# EasyEDA Pro project stm32h7手持mp3.eprj, schematic Schematic1
Board Name: Board1; Create Date: 2026-05-27; Page Name: mcu; Project Name: stm32h7手持mp3; Schematic Name: Schematic1; Update Date: 2026-06-16; Company: 嘉立创EDA; Page Size: A4; Version: V1.0
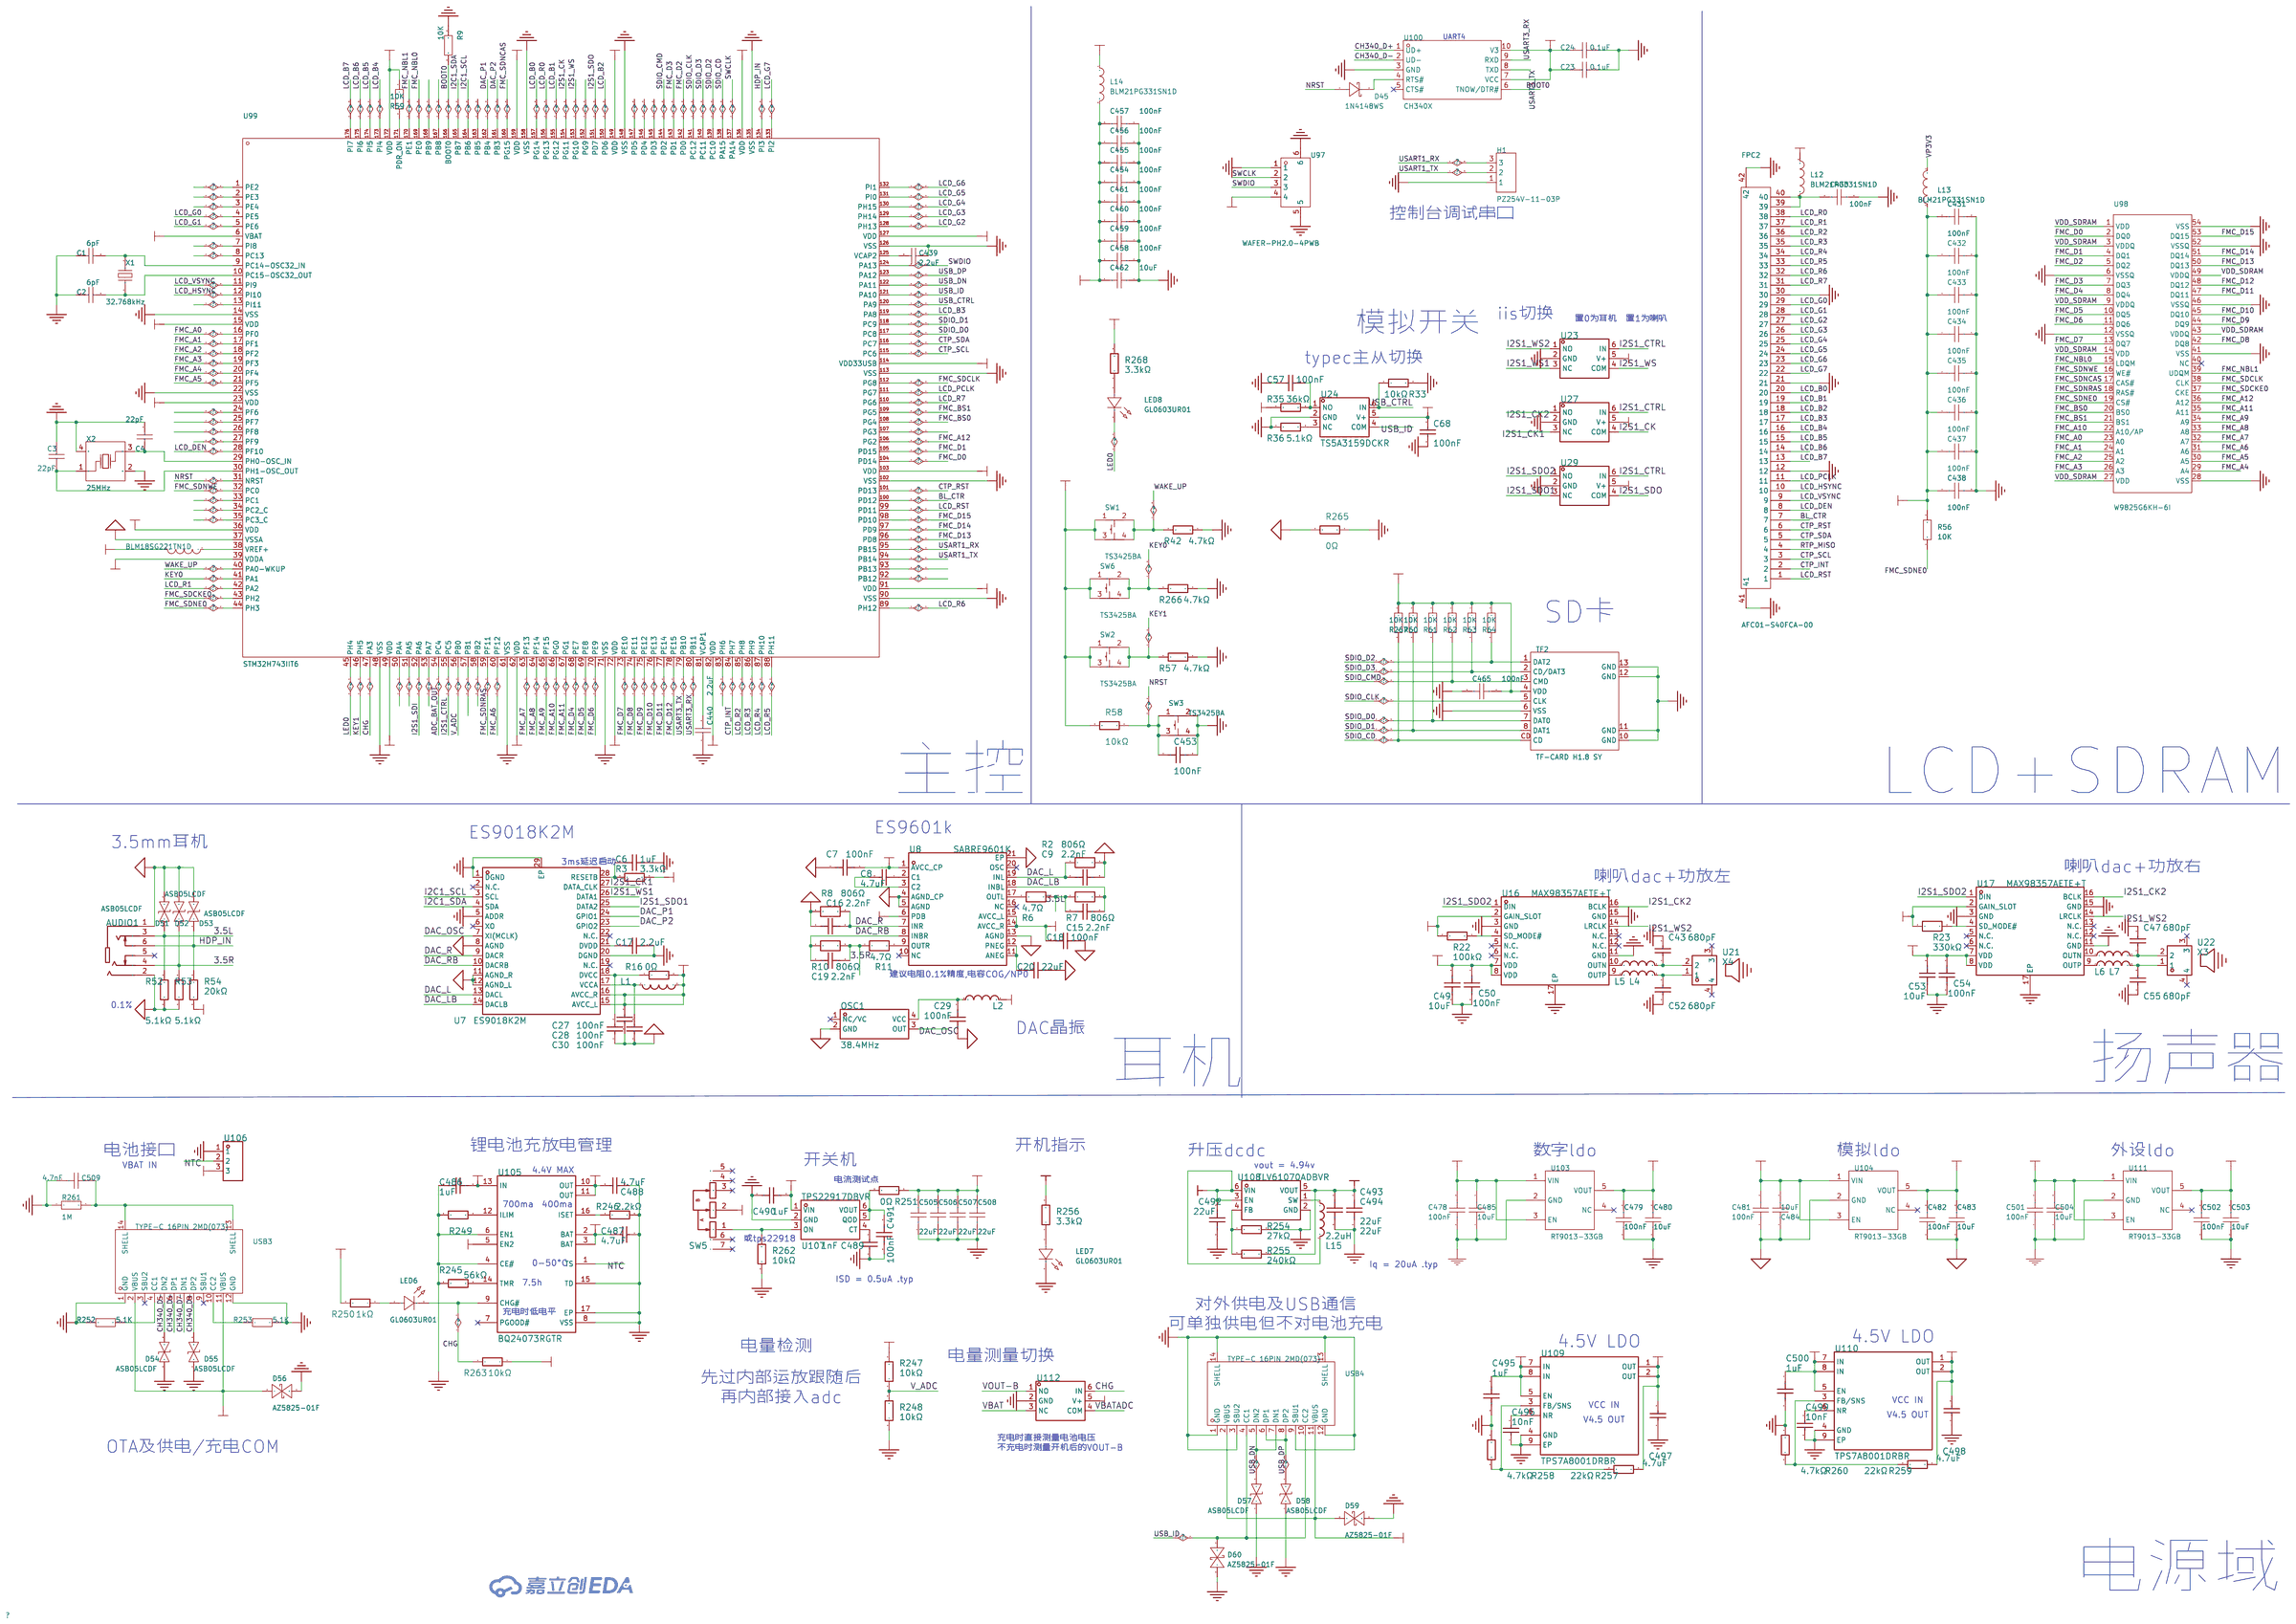
[diagram p0: schematic sheet]

## Parts
AUDIO1  PJ-3420-A-SMT  [AUDIO-SMD_PJ-3420-A-SMT_C319102]
C1  6pF  [C0603]
C2  6pF  [C0603]
C3  22pF  [C0603]
C4  22pF  [C0603]
C6  1uF  [C0603]
C7  100nF  [C0603]
C8  4.7uF  [C0603]
C9  2.2nF  [C0603]
C15  2.2nF  [C0603]
C16  2.2nF  [C0603]
C17  2.2uF  [C0603]
C18  100nF  [C0603]
C19  2.2nF  [C0603]
C20  22uF  [C0603]
C23  0.1uF  [C0603]
C24  0.1uF  [C0603]
C27  100nF  [C0603]
C28  100nF  [C0603]
C29  100nF  [C0603]
C30  100nF  [C0603]
C43  680pF  [C0603]
C47  680pF  [C0603]
C49  10uF  [C0603]
C50  100nF  [C0603]
C52  680pF  [C0603]
C53  10uF  [C0603]
C54  100nF  [C0603]
C55  680pF  [C0603]
C57  100nF  [C0603]
C68  100nF  [C0603]
C430  100nF  [C0603]
C431  100nF  [C0603]
C432  100nF  [C0603]
C433  100nF  [C0603]
C434  100nF  [C0603]
C435  100nF  [C0603]
C436  100nF  [C0603]
C437  100nF  [C0603]
C438  100nF  [C0603]
C439  2.2uF  [C0603]
C440  2.2uF  [C0603]
C453  100nF  [C0603]
C454  100nF  [C0603]
C455  100nF  [C0603]
C456  100nF  [C0603]
C457  100nF  [C0603]
C458  100nF  [C0603]
C459  100nF  [C0603]
C460  100nF  [C0603]
C461  100nF  [C0603]
C462  10uF  [C0603]
C465  100nF  [C0603]
C478  100nF  [C0603]
C479  100nF  [C0603]
C480  10uF  [C0603]
C481  100nF  [C0603]
C482  100nF  [C0603]
C483  10uF  [C0603]
C484  10uF  [C0603]
C485  10uF  [C0603]
C486  1uF  [C0603]
C487  4.7uF  [C0603]
C488  4.7uF  [C0603]
C489  1nF  [C0603]
C490  1uF  [C0603]
C491  100nF  [C0603]
C492  22uF  [C0603]
C493  22uF  [C0603]
C494  22uF  [C0603]
C495  1uF  [C0603]
C496  10nF  [C0603]
C497  4.7uF  [C0603]
C498  4.7uF  [C0603]
C499  10nF  [C0603]
C500  1uF  [C0603]
C501  100nF  [C0603]
C502  100nF  [C0603]
C503  10uF  [C0603]
C504  10uF  [C0603]
C505  22uF  [C0805]
C506  22uF  [C0805]
C507  22uF  [C0805]
C508  22uF  [C0805]
C509  4.7nF  [C0603]
D45  1N4148WS  [SOD-323_L1.7-W1.3-LS2.5-FD]
D51  ASB05LCDF  [DFN-2L_L1.0-W0.6-P0.65-BI]
D52  ASB05LCDF  [DFN-2L_L1.0-W0.6-P0.65-BI]
D53  ASB05LCDF  [DFN-2L_L1.0-W0.6-P0.65-BI]
D54  ASB05LCDF  [DFN-2L_L1.0-W0.6-P0.65-BI]
D55  ASB05LCDF  [DFN-2L_L1.0-W0.6-P0.65-BI]
D56  AZ5825-01F  [DFN-2L_L1.0-W0.6-P0.65-BI]
D57  ASB05LCDF  [DFN-2L_L1.0-W0.6-P0.65-BI]
D58  ASB05LCDF  [DFN-2L_L1.0-W0.6-P0.65-BI]
D59  AZ5825-01F  [DFN-2L_L1.0-W0.6-P0.65-BI]
D60  AZ5825-01F  [DFN-2L_L1.0-W0.6-P0.65-BI]
FPC2  AFC01-S40FCA-00  [FPC-SMD_AFC01-S40FCA-00]
H1  PZ254V-11-03P  [HDR-TH_3P-P2.54-V-M_PZ254V-11-03P]
L1  BLM18EG221SN1D  [L0603]
L2  BLM18EG221SN1D  [L0603]
L4  BLM18EG221SN1D  [L0603]
L5  BLM18EG221SN1D  [L0603]
L6  BLM18EG221SN1D  [L0603]
L7  BLM18EG221SN1D  [L0603]
L11  BLM18SG221TN1D  [L0603]
L12  BLM21PG331SN1D  [L0805]
L13  BLM21PG331SN1D  [L0805]
L14  BLM21PG331SN1D  [L0805]
L15  2.2uH  [IND-SMD_L5.4-W5.2_FXL0530]
LED6  GL0603UR01  [LED0603-FD]
LED7  GL0603UR01  [LED0603-FD]
LED8  GL0603UR01  [LED0603-FD]
OSC1  38.4MHz  [OSC-SMD_4P-L2.0-W1.6-BL_DSB211SDN]
R2  806Ω  [R0603]
R3  3.3kΩ  [R0603]
R6  4.7Ω  [R0603]
R7  806Ω  [R0603]
R8  806Ω  [R0603]
R9  10K  [R0603]
R10  806Ω  [R0603]
R11  4.7Ω  [R0603]
R16  0Ω  [R0603]
R22  100kΩ  [R0603]
R23  330kΩ  [R0603]
R33  10kΩ  [R0603]
R35  36kΩ  [R0603]
R36  5.1kΩ  [R0603]
R42  4.7kΩ  [R0603]
R52  5.1kΩ  [R0603]
R53  5.1kΩ  [R0603]
R54  20kΩ  [R0603]
R56  10K  [R0603]
R57  4.7kΩ  [R0603]
R58  10kΩ  [R0603]
R59  10K  [R0603]
R60  10K  [R0603]
R61  10K  [R0603]
R62  10K  [R0603]
R63  10K  [R0603]
R64  10K  [R0603]
R245  56kΩ  [R0603]
R246  2.2kΩ  [R0603]
R247  10kΩ  [R0603]
R248  10kΩ  [R0603]
R249  2.2kΩ  [R0603]
R250  1kΩ  [R0603]
R251  0Ω  [R0603]
R252  5.1K  [R0603]
R253  5.1K  [R0603]
R254  27kΩ  [R0603]
R255  240kΩ  [R0603]
R256  3.3kΩ  [R0603]
R257  22kΩ  [R0603]
R258  4.7kΩ  [R0603]
R259  22kΩ  [R0603]
R260  4.7kΩ  [R0603]
R261  1M  [R0603]
R262  10kΩ  [R0603]
R263  10kΩ  [R0603]
R265  0Ω  [R0603]
R266  4.7kΩ  [R0603]
R267  10K  [R0603]
R268  3.3kΩ  [R0603]
SW1  TS3425BA  [SW-SMD_4P-L4.2-W3.2-P2.15-LS4.6-1]
SW2  TS3425BA  [SW-SMD_4P-L4.2-W3.2-P2.15-LS4.6-1]
SW3  TS3425BA  [SW-SMD_4P-L4.2-W3.2-P2.15-LS4.6-1]
SW5  MK-12C02-G020  [SW-SMD_MK-12C02-G020]
SW6  TS3425BA  [SW-SMD_4P-L4.2-W3.2-P2.15-LS4.6-1]
TF2  TF-CARD H1.8 SY  [TF-SMD_TF-012]
U7  ES9018K2M  [QFN-28_L5.0-W5.0-P0.50-BL-EP3.3]
U8  SABRE9601K  [QFN-20_L3.0-W3.0-P0.40-TL-EP1.7]
U16  MAX98357AETE+T  [TQFN-16_L3.0-W3.0-P0.50-BL-EP1.5]
U17  MAX98357AETE+T  [TQFN-16_L3.0-W3.0-P0.50-BL-EP1.5]
U21  -  [扬声器左]
U22  -  [扬声器右]
U23  TS5A3159DCKR  [SC-70-6_L2.0-W1.3-P0.65-LS2.1-BL-1]
U24  TS5A3159DCKR  [SC-70-6_L2.0-W1.3-P0.65-LS2.1-BL-1]
U27  TS5A3159DCKR  [SC-70-6_L2.0-W1.3-P0.65-LS2.1-BL-1]
U29  TS5A3159DCKR  [SC-70-6_L2.0-W1.3-P0.65-LS2.1-BL-1]
U97  WAFER-PH2.0-4PWB  [CONN-SMD_4P-P2.00_XUNPU_WAFER-PH2.0-4PWB]
U98  W9825G6KH-6I  [TSOP-54_L22.2-W10.2-P0.80-LS11.8-BL]
U99  STM32H743IIT6  [LQFP-176_L24.0-W24.0-P0.50-LS26.0-BL]
U100  CH340X  [MSOP-10_L3.0-W3.0-P0.50-LS5.0-BL]
U103  RT9013-33GB  [SOT-23-5_L3.0-W1.7-P0.95-LS2.8-BL]
U104  RT9013-33GB  [SOT-23-5_L3.0-W1.7-P0.95-LS2.8-BL]
U105  BQ24073RGTR  [QFN-16_L3.0-W3.0-P0.50-TL-EP1.7]
U106  BX-PH2.0-3PWZ  [CONN-TH_3P-P2.00_BX-PH2.0-3PWZ]
U107  TPS22917DBVR  [SOT-23-6_L2.9-W1.6-P0.95-LS2.8-BR]
U108  TLV61070ADBVR  [SOT-23-6_L2.9-W1.6-P0.95-LS2.8-BR]
U109  TPS7A8001DRBR  [VSON-8_L3.0-W3.0-P0.65-TL-EP]
U110  TPS7A8001DRBR  [VSON-8_L3.0-W3.0-P0.65-TL-EP]
U111  RT9013-33GB  [SOT-23-5_L3.0-W1.7-P0.95-LS2.8-BL]
U112  TS5A3159DCKR  [SC-70-6_L2.0-W1.3-P0.65-LS2.1-BL-1]
USB3  TYPE-C 16PIN 2MD(073)  [USB-C-SMD_TYPE-C-6PIN-2MD-073]
USB4  TYPE-C 16PIN 2MD(073)  [USB-C-SMD_TYPE-C-6PIN-2MD-073]
X1  32.768kHz  [OSC-SMD_L3.2-W1.5]
X2  25MHz  [CRYSTAL-SMD_4P-L3.2-W2.5-BL]
X3  GH125-S02DCA-00  [CONN-SMD_2P-P1.25_JUSHUO_GH125-S02DCA-00]
X4  GH125-S02DCA-00  [CONN-SMD_2P-P1.25_JUSHUO_GH125-S02DCA-00]

## Library data of the parts
AUDIO1 = PJ-3420-A-SMT: 连接器类型:3.5mm耳机座;额定电流:500mA;额定电压:30V;工作温度:-20℃~+70℃;; LCSC Part Name: 3.5mm耳机座; Supplier Part: C319102; Manufacturer: XKB Connection(中国星坤); Supplier Footprint: SMD; JLCPCB Part Class: Extended Part; Datasheet: https://item.szlcsc.com/datasheet/PJ-3420-A-SMT/300194.html; Supplier: LCSC; Connector Type: 3.5mm耳机座; Current Rating (Max): 500mA; Voltage Rating (Max): 30V; Operating Temperature Range: -20℃~+70℃; Soldering Temperature(Max): 235℃; Current Rating: 500mA; Operating Temperature: -20℃~+70℃
C1-C4 C23 C24 C439 C440 = 0603CG6R0C500NT: 容值:6pF;额定电压:50V;温度系数:C0G;; LCSC Part Name: ±0.25pF 6pF 50V; Supplier Part: C37474; Manufacturer: FH(风华); Supplier Footprint: 0603; JLCPCB Part Class: 扩展库; Datasheet: https://atta.szlcsc.com/upload/public/pdf/source/20200305/C486355_26A10D38EF8C2A5C37091D0039909270.pdf; Supplier: LCSC; Voltage Rating: 50V; Temperature Coefficient: C0G
C6 C486 C490 = CC0603JRX7R7BB105: LCSC Part Name: 1uF ±5% 16V; Supplier Part: C519560; Manufacturer: YAGEO(国巨); Supplier Footprint: 0603; JLCPCB Part Class: 扩展库; Datasheet: https://atta.szlcsc.com/upload/public/pdf/source/20200423/C519560_04055A817EC1D690632F33783E937415.pdf; Supplier: LCSC; Tolerance: ±5%; Voltage Rated: 16V; Temperature Coefficient: X7R
C7 C18 C29 C50 C54 C453 C491 = CGA0603X7R104K500JT: LCSC Part Name: 100nF ±10% 50V; Supplier Part: C6119867; Manufacturer: HRE(芯声); Supplier Footprint: 0603; Supplier: LCSC; Tolerance: ±10%; Voltage Rated: 50V; Temperature Coefficient: X7R
C8 C487 C488 = CL10A475KO8NNNC: LCSC Part Name: 4.7uF ±10% 16V; Supplier Part: C19666; Manufacturer: SAMSUNG(三星); Supplier Footprint: 0603; Datasheet: https://atta.szlcsc.com/upload/public/pdf/source/20160218/1457707763339.pdf; Supplier: LCSC; Tolerance: ±10%; Voltage Rated: 16V; Temperature Coefficient: X5R
C9 C15 C16 C19 = GRM1885C1H222FA01D: LCSC Part Name: 2.2nF ±1% 50V 停产; Supplier Part: C882523; Manufacturer: muRata(村田); Supplier Footprint: 0603; JLCPCB Part Class: 扩展库; Datasheet: https://atta.szlcsc.com/upload/public/pdf/source/20220630/6FA8AFF045350095082060A18D4DB533.pdf; Supplier: LCSC; Tolerance: ±1%; Voltage Rated: 50V; Temperature Coefficient: C0G
C17 = CL10A225KB8NNNC: LCSC Part Name: 2.2uF ±10% 50V; Supplier Part: C913904; Manufacturer: SAMSUNG(三星); Supplier Footprint: 0603; JLCPCB Part Class: 扩展库; Datasheet: https://atta.szlcsc.com/upload/public/pdf/source/20160218/1457707763339.pdf; Supplier: LCSC; Tolerance: ±10%; Voltage Rated: 50V; Temperature Coefficient: X5R
C20 = CL10A226MP8NUNE: LCSC Part Name: 22uF ±20% 10V; Supplier Part: C86295; Manufacturer: SAMSUNG(三星); Supplier Footprint: 0603; JLCPCB Part Class: 扩展库; Datasheet: https://atta.szlcsc.com/upload/public/pdf/source/20160218/1457707763339.pdf; Supplier: LCSC; Tolerance: ±20%; Voltage Rated: 10V; Temperature Coefficient: X5R
C27 C28 C30 C57 C68 = 0603B104K500NT: LCSC Part Name: 100nF ±10% 50V; Supplier Part: C30926; Manufacturer: FH(风华); Supplier Footprint: 0603; JLCPCB Part Class: 扩展库; Datasheet: https://atta.szlcsc.com/upload/public/pdf/source/20200305/C486355_26A10D38EF8C2A5C37091D0039909270.pdf; Supplier: LCSC; Tolerance: ±10%; Voltage Rating: 50V; Temperature Coefficient: X7R
C43 C47 C52 C55 = CC0603JRNPO9BN681: LCSC Part Name: 680pF ±5% 50V; Supplier Part: C107055; Manufacturer: YAGEO(国巨); Supplier Footprint: 0603; JLCPCB Part Class: 扩展库; Datasheet: https://atta.szlcsc.com/upload/public/pdf/source/20170914/C128857_1505359892143968080.pdf; Supplier: LCSC; Tolerance: ±5%; Voltage Rated: 50V; Temperature Coefficient: NP0
C49 C53 = CGA0603X5R106K100JT: LCSC Part Name: 10uF ±10% 10V; Supplier Part: C6119842; Manufacturer: HRE(芯声); Supplier Footprint: 0603; JLCPCB Part Class: 扩展库; Supplier: LCSC; Tolerance: ±10%; Voltage Rated: 10V; Temperature Coefficient: X5R
C430-C438 C454-C462 C465 C478-C485 C501-C504 C509 = CAP_0603: Supplier Footprint: 0603
C489 = CC0603KRX7R9BB102: LCSC Part Name: 1nF ±10% 50V; Supplier Part: C100040; Manufacturer: YAGEO(国巨); Supplier Footprint: 0603; Datasheet: https://atta.szlcsc.com/upload/public/pdf/source/20180910/C282072_33301C7F631E79921B82A8DAC6BCC5B3.pdf; Supplier: LCSC; Tolerance: ±10%; Voltage Rated: 50V; Temperature Coefficient: X7R
C492-C494 = CL10A226MO7JZNC: LCSC Part Name: 22uF ±20% 16V; Supplier Part: C2762594; Manufacturer: SAMSUNG(三星); Supplier Footprint: 0603; JLCPCB Part Class: 扩展库; Datasheet: https://item.szlcsc.com/datasheet/CL10A226MO7JZNC/2889856.html; Supplier: LCSC; Tolerance: ±20%; Voltage Rating: 16V; Temperature Coefficient: X5R
C495 C500 = CL10A105KB8NNNC: LCSC Part Name: 1uF ±10% 50V; Supplier Part: C15849; Manufacturer: SAMSUNG(三星); Supplier Footprint: 0603; JLCPCB Part Class: 基础库; Datasheet: https://atta.szlcsc.com/upload/public/pdf/source/20160218/1457707763339.pdf; Supplier: LCSC; Tolerance: ±10%; Voltage Rated: 50V; Temperature Coefficient: X5R
C496 C499 = CC0603KRX7R9BB103: LCSC Part Name: 10nF ±10% 50V; Supplier Part: C100042; Manufacturer: YAGEO(国巨); Supplier Footprint: 0603; JLCPCB Part Class: 扩展库; Datasheet: https://atta.szlcsc.com/upload/public/pdf/source/20181008/C309510_22F155564471FAF6A489F7D68F34234E.pdf; Supplier: LCSC; Tolerance: ±10%; Voltage Rated: 50V; Temperature Coefficient: X7R
C497 C498 = CL10A475KA8NQNC: LCSC Part Name: 4.7uF ±10% 25V; Supplier Part: C69335; Manufacturer: SAMSUNG(三星); Supplier Footprint: 0603; JLCPCB Part Class: 扩展库; Datasheet: https://atta.szlcsc.com/upload/public/pdf/source/20161108/1478586410580.pdf; Supplier: LCSC; Tolerance: ±10%; Voltage Rated: 25V; Temperature Coefficient: X5R
C505-C508 = CGA0805X5R226M250MT: LCSC Part Name: 22uF ±20% 25V; Supplier Part: C6119899; Manufacturer: HRE(芯声); Supplier Footprint: 0805; JLCPCB Part Class: 扩展库; Datasheet: https://item.szlcsc.com/datasheet/CGA0805X5R226M250MT/7062605.html; Supplier: LCSC; Tolerance: ±20%; Voltage Rating: 25V; Temperature Coefficient: X5R
D45 = 1N4148WS_C7420319: 二极管配置:独立式;正向压降(Vf):1.25V@150mA;直流反向耐压(Vr):100V;整流电流:150mA;反向恢复时间(trr):4ns;; Supplier Part: C7420319; Manufacturer: 宏迦橙; Supplier Footprint: SOD-323; JLCPCB Part Class: Extended Part; Datasheet: https://atta.szlcsc.com/upload/public/pdf/source/20240228/ACAE8A2B901F2FD417588BC59863BC16.pdf; Supplier: LCSC; Diode Configuration: 独立式; Forward Voltage (Vf@If): 1.25V@150mA; Reverse Voltage (Vr): 100V; Rectified Current: 150mA; Reverse Leakage Current (Ir): 1uA@75V; Reverse Recovery Time (trr): 4ns; Operating Temperature: -55℃~+150℃
D51-D55 D57 D58 = ASB05LCDF: Supplier Part: C397790; Manufacturer: AnBon(安邦); Supplier Footprint: DFN1006-2L; JLCPCB Part Class: 扩展库; Datasheet: https://atta.szlcsc.com/upload/public/pdf/source/20190805/C397790_C524EC52E327E04779045C288D4F79CB.pdf; Supplier: LCSC
D56 D59 D60 = AZ5825-01F: 极性:双向;反向截止电压(Vrwm):5V;最大钳位电压:8.5V;峰值脉冲电流(Ipp):19A;峰值脉冲功率(Ppp):140W;击穿电压:6V;; Supplier Part: C2905641; Manufacturer: TECH PUBLIC(台舟); Supplier Footprint: DFN1006; JLCPCB Part Class: 扩展库; Datasheet: https://atta.szlcsc.com/upload/public/pdf/source/20211021/70C3E913D933D7E3DC4BF63E1717BCD0.pdf; Supplier: LCSC; polarity: 双向; Reverse Stand-Off Voltage (Vrwm): 5V; Maximum Clamping Voltage: 8.5V; Peak Pulse Current (Ipp): 19A; Peak Pulse Power Dissipation (Ppp): 140W; Breakdown Voltage: 6V; Reverse Leakage Current (Ir): 80nA; Number of Lines: 单路; Operating Temperature: -55℃~+125℃; level of protection: IEC 61000-4-2; Type: ESD
FPC2 = AFC01-S40FCA-00: LCSC Part Name: 翻盖式 下接 P数:40P 间距:0.5mm; Supplier Part: C262674; Manufacturer: JS(钜硕电子); Supplier Footprint: SMD,P=0.5mm,卧贴; JLCPCB Part Class: 扩展库; Datasheet: https://item.szlcsc.com/datasheet/AFC01-S40FCA-00/253933.html; Supplier: LCSC; Locking Feature: 翻盖式; Contact Type: 下接; Number of Contacts: 40P; Pitch: 0.5mm; Mounting Type: 卧贴; FFC, FCB Thickness: 0.3mm; Height Above Board: 2mm; Contact Material: 铜合金; Contact Plating: 锡; Operating Temperature: -45℃~+85℃; Rated Voltage (Max): 50V; Current Rating (Max): 500mA
H1 = PZ254V-11-03P: LCSC Part Name: 1x3P 间距:2.54mm 方针 直插; Supplier Part: C2937625; Manufacturer: XFCN(兴飞); Supplier Footprint: 插件,P=2.54mm; JLCPCB Part Class: 扩展库; Datasheet: https://item.szlcsc.com/datasheet/PZ254V-11-03P/3293280.html; Supplier: LCSC; Pin Structure: 1x3P; Pitch: 2.54mm; Circluar Pins/Square Pins: 方针; Mounting Type: 直插; Number of Rows: 单排; Number of Pins: 3P; Current Rating: 3A; Voltage Rating (Max): 250V; Length of Mating Pin: 6mm; Insulation Height: 2.5mm; Length of End Connection Pin: 3mm; Operating Temperature: -40℃~+105℃; Color: 黑色
L1 L2 L4-L7 = BLM18EG221SN1D: LCSC Part Name: 单路 0603磁珠 阻抗220Ω@100MHz; Supplier Part: C85827; Manufacturer: muRata(村田); Supplier Footprint: 0603; Datasheet: https://atta.szlcsc.com/upload/public/pdf/source/20170523/1495533955417.pdf; Supplier: LCSC; Impedance @ Frequency: 220Ω@100MHz; Tolerance: ±25%; DC Resistance: 50mΩ; Current Rating: 2A; Circuits: 1
L11 = BLM18SG221TN1D: 标称阻抗@测试频率:220Ω@100MHz;误差:±25%;直流电阻(RDC):40mΩ;; LCSC Part Name: 单路 0603磁珠 阻抗220Ω@100MHz; Supplier Part: C88988; Manufacturer: muRata(村田); Supplier Footprint: 0603; JLCPCB Part Class: 扩展库; Datasheet: https://atta.szlcsc.com/upload/public/pdf/source/20180329/C160981_FD3C2D2622A377E203B89F4AA32B0741.pdf; Supplier: LCSC; Impedance @ Frequency: 220Ω@100MHz; Tolerance: ±25%; DC Resistance: 40mΩ; Current Rating: 2.5A; Circuits: 1
L12-L14 = BLM21PG331SN1D: LCSC Part Name: 单路 0805磁珠 阻抗330Ω@100MHz; Supplier Part: C74764; Manufacturer: muRata(村田); Supplier Footprint: 0805; JLCPCB Part Class: 扩展库; Datasheet: https://item.szlcsc.com/datasheet/BLM21PG331SN1D/75886.html; Supplier: LCSC; Impedance @ Frequency: 330Ω@100MHz; Tolerance: ±25%; DC Resistance(DCR): 70mΩ; Current Rating: 1.5A; Number of Circuits: 1
L15 = FXL0530-2R2-M: LCSC Part Name: 2.2uH ±20% 7.5A; Supplier Part: C177247; Manufacturer: cjiang(长江微电); Supplier Footprint: SMD,5.2x5.4mm; JLCPCB Part Class: 扩展库; Datasheet: https://atta.szlcsc.com/upload/public/pdf/source/20240426/3189EA8206330E2108542F9E34E540E7.pdf; Supplier: LCSC; Tolerance: ±20%; Rated Current: 7A; Saturation Current (Isat): 7.5A; DC Resistance (DCR): 29mΩ; Type: 一体成型电感
LED6-LED8 = GL0603UR01: LCSC Part Name: 0603 红灯 高亮; Supplier Part: C51933292; Manufacturer: Guiguang light(桂光光电); Supplier Footprint: 0603; JLCPCB Part Class: 扩展库; Datasheet: https://item.szlcsc.com/datasheet/GL0603UR01/54645988.html; Supplier: LCSC; Illumination Color: 红色; Voltage - Forward(Vf): 2.4V; Forward Current: 20mA; Wavelength - Dominant: 620nm~625nm; Diode Configuration: 独立二极管; Lens Color: 无色透明透镜; Luminous Intensity: 120mcd; Viewing Angle: 120°; Mounting Style: 正贴; Operating Temperature: -40℃~+85℃
OSC1 = TG2016SMN 38.4000M-MCGNNM3: LCSC Part Name: 38.4MHz ±500ppb 2.8V~3.3V; Supplier Part: C1987359; Manufacturer: EPSON(爱普生); Supplier Footprint: SMD2016-4P; JLCPCB Part Class: 扩展库; Datasheet: https://atta.szlcsc.com/upload/public/pdf/source/20220614/17FACADA97E07346962B8957FA8EBF1D.pdf; Supplier: LCSC; Frequency Stability(Full temperature range): ±500ppb; Output Type: 削峰正弦波; Supply Voltage: 2.8V~3.3V; Supply Current (Max): 1.8mA; Operating Temperature: -40℃~+85℃
R2 R7 R8 R10 = RT0603BRD07806RL: LCSC Part Name: 薄膜电阻 806Ω ±0.1% 100mW; Supplier Part: C861567; Manufacturer: YAGEO(国巨); Supplier Footprint: 0603; JLCPCB Part Class: 扩展库; Datasheet: https://atta.szlcsc.com/upload/public/pdf/source/20200610/C326738_5639A9F1B6EB6E4AE2197577D3456E7F.pdf; Supplier: LCSC; Type: 薄膜电阻; Tolerance: ±0.1%; Power(Watts): 100mW; Temperature Coefficient: ±25ppm/℃; Operating Temperature Range: -55℃~+155℃
R3 R256 R268 = 0603WAF3301T5E: LCSC Part Name: 3.3kΩ ±1% 100mW 厚膜电阻; Supplier Part: C22978; Manufacturer: UNI-ROYAL(厚声); Supplier Footprint: 0603; JLCPCB Part Class: Basic Part; Datasheet: https://item.szlcsc.com/datasheet/0603WAF3301T5E/23705.html; Supplier: LCSC; Type: 厚膜电阻; Tolerance: ±1%; Power(Watts): 100mW; Voltage-Supply(Max): 75V; Temperature Coefficient: ±100ppm/℃; Operating Temperature: -55℃~+155℃
R6 R11 = RT0603BRD074R7L: LCSC Part Name: 薄膜电阻 4.7Ω ±0.1% 100mW; Supplier Part: C861448; Manufacturer: YAGEO(国巨); Supplier Footprint: 0603; JLCPCB Part Class: 扩展库; Datasheet: https://atta.szlcsc.com/upload/public/pdf/source/20200610/C326738_5639A9F1B6EB6E4AE2197577D3456E7F.pdf; Supplier: LCSC; Type: 薄膜电阻; Tolerance: ±0.1%; Power(Watts): 100mW; Temperature Coefficient: ±25ppm/℃; Operating Temperature: -55℃~+155℃
R9 R56 R59-R64 R252 R253 R261 R267 = Res_0603: Supplier Footprint: 0603
R16 R251 = 0603WAF0000T5E: LCSC Part Name: 0Ω ±1% 100mW 厚膜电阻; Supplier Part: C21189; Manufacturer: UNI-ROYAL(厚声); Supplier Footprint: 0603; Datasheet: https://atta.szlcsc.com/upload/public/pdf/source/20200306/C422600_1E6D84923E4A46A82E41ADD87F860B5C.pdf; Supplier: LCSC; Type: 厚膜电阻; Tolerance: ±1%; Power(Watts): 100mW; Overload Voltage (Max): 75V; Operating Temperature Range: -55℃~+155℃
R22 R33 R42 R57 R58 R247 R262 R265 R266 = 0603WAF1002T5E: LCSC Part Name: 厚膜电阻 10kΩ ±1% 100mW; Supplier Part: C25804; Manufacturer: UNI-ROYAL(厚声); Supplier Footprint: 0603; JLCPCB Part Class: 基础库; Datasheet: https://atta.szlcsc.com/upload/public/pdf/source/20200306/C422600_1E6D84923E4A46A82E41ADD87F860B5C.pdf; Supplier: LCSC; Type: 厚膜电阻; Tolerance: ±1%; Power(Watts): 100mW; Overload Voltage (Max): 75V; Temperature Coefficient: ±100ppm/℃; Operating Temperature Range: -55℃~+155℃
R23 = FRC0603F3303TS: LCSC Part Name: 330kΩ ±1% 100mW 厚膜电阻; Supplier Part: C2907027; Manufacturer: FOJAN(富捷); Supplier Footprint: 0603; JLCPCB Part Class: 扩展库; Datasheet: https://item.szlcsc.com/datasheet/FRC0603F3303TS/3180540.html; Supplier: LCSC; Type: 厚膜电阻; Tolerance: ±1%; Power(Watts): 100mW; Voltage-Supply(Max): 75V; Temperature Coefficient: ±100ppm/℃; Operating Temperature: -55℃~+155℃
R35 = RC0603FR-0736KL: LCSC Part Name: 厚膜电阻 36kΩ ±1% 100mW; Supplier Part: C114619; Manufacturer: YAGEO(国巨); Supplier Footprint: 0603; JLCPCB Part Class: 扩展库; Datasheet: https://atta.szlcsc.com/upload/public/pdf/source/20180821/C275644_0D56F95EFF785E7D9A1FEF436B37DA78.pdf; Supplier: LCSC; Type: 厚膜电阻; Tolerance: ±1%; Power(Watts): 100mW; Overload Voltage (Max): 75V; Temperature Coefficient: ±100ppm/℃; Operating Temperature Range: -55℃~+155℃
R36 = 0603WAF5101T5E: LCSC Part Name: 5.1kΩ ±1% 100mW 厚膜电阻; Supplier Part: C23186; Manufacturer: UNI-ROYAL(厚声); Supplier Footprint: 0603; Datasheet: https://atta.szlcsc.com/upload/public/pdf/source/20200306/C422600_1E6D84923E4A46A82E41ADD87F860B5C.pdf; Supplier: LCSC; Type: 厚膜电阻; Tolerance: ±1%; Power(Watts): 100mW; Overload Voltage (Max): 75V; Temperature Coefficient: ±100ppm/℃; Operating Temperature Range: -55℃~+155℃
R52 R53 = RT0603BRD075K1L: LCSC Part Name: 薄膜电阻 5.1kΩ ±0.1% 100mW; Supplier Part: C122969; Manufacturer: YAGEO(国巨); Supplier Footprint: 0603; JLCPCB Part Class: 扩展库; Datasheet: https://atta.szlcsc.com/upload/public/pdf/source/20170728/C122969_1501225761505848820.pdf; Supplier: LCSC; Type: 薄膜电阻; Tolerance: ±0.1%; Power(Watts): 100mW; Overload Voltage (Max): 75V; Temperature Coefficient: ±25ppm/℃; Operating Temperature Range: -55℃~+155℃
R54 R248 = 0603WAF2002T5E: LCSC Part Name: 20kΩ ±1% 100mW 厚膜电阻; Supplier Part: C4184; Manufacturer: UNI-ROYAL(厚声); Supplier Footprint: 0603; JLCPCB Part Class: 基础库; Datasheet: https://item.szlcsc.com/datasheet/0603WAF2002T5E/4591.html; Supplier: LCSC; Type: 厚膜电阻; Tolerance: ±1%; Power(Watts): 100mW; Voltage-Supply(Max): 75V; Temperature Coefficient: ±100ppm/℃; Operating Temperature: -55℃~+155℃
R245 = 0603WAF5602T5E: LCSC Part Name: 56kΩ ±1% 100mW 厚膜电阻; Supplier Part: C23206; Manufacturer: UNI-ROYAL(厚声); Supplier Footprint: 0603; Datasheet: https://atta.szlcsc.com/upload/public/pdf/source/20200306/C422600_1E6D84923E4A46A82E41ADD87F860B5C.pdf; Supplier: LCSC; Type: 厚膜电阻; Tolerance: ±1%; Power(Watts): 100mW; Overload Voltage (Max): 75V; Temperature Coefficient: ±100ppm/℃; Operating Temperature Range: -55℃~+155℃
R246 = 0603WAF2201T5E: LCSC Part Name: 2.2kΩ ±1% 100mW 厚膜电阻; Supplier Part: C4190; Manufacturer: UNI-ROYAL(厚声); Supplier Footprint: 0603; JLCPCB Part Class: 基础库; Datasheet: https://atta.szlcsc.com/upload/public/pdf/source/20200306/C422600_1E6D84923E4A46A82E41ADD87F860B5C.pdf; Supplier: LCSC; Type: 厚膜电阻; Tolerance: ±1%; Power(Watts): 100mW; Overload Voltage (Max): 75V; Temperature Coefficient: ±100ppm/℃; Operating Temperature Range: -55℃~+155℃
R249 = 0603WAF2201T5E: 电阻类型:厚膜电阻;阻值:2.2kΩ;精度:±1%;功率:100mW;最大工作电压:75V;温度系数:±100ppm/℃;; LCSC Part Name: 2.2kΩ ±1% 100mW 厚膜电阻; Supplier Part: C4190; Manufacturer: UNI-ROYAL(厚声); Supplier Footprint: 0603; JLCPCB Part Class: 基础库; Datasheet: https://atta.szlcsc.com/upload/public/pdf/source/20200306/C422600_1E6D84923E4A46A82E41ADD87F860B5C.pdf; Supplier: LCSC; Type: 厚膜电阻; Tolerance: ±1%; Power(Watts): 100mW; Overload Voltage (Max): 75V; Temperature Coefficient: ±100ppm/℃; Operating Temperature Range: -55℃~+155℃
R250 R263 = 0603WAF1001T5E: LCSC Part Name: 1kΩ ±1% 100mW 厚膜电阻; Supplier Part: C21190; Manufacturer: UNI-ROYAL(厚声); Supplier Footprint: 0603; Datasheet: https://atta.szlcsc.com/upload/public/pdf/source/20200306/C422600_1E6D84923E4A46A82E41ADD87F860B5C.pdf; Supplier: LCSC; Type: 厚膜电阻; Tolerance: ±1%; Power(Watts): 100mW; Overload Voltage (Max): 75V; Temperature Coefficient: ±100ppm/℃; Operating Temperature Range: -55℃~+155℃
R254 = 0603WAF2702T5E: LCSC Part Name: 27kΩ ±1% 100mW 厚膜电阻; Supplier Part: C22967; Manufacturer: UNI-ROYAL(厚声); Supplier Footprint: 0603; JLCPCB Part Class: Basic Part; Datasheet: https://item.szlcsc.com/datasheet/0603WAF2702T5E/23694.html; Supplier: LCSC; Type: 厚膜电阻; Tolerance: ±1%; Power(Watts): 100mW; Voltage-Supply(Max): 75V; Temperature Coefficient: ±100ppm/℃; Operating Temperature: -55℃~+155℃
R255 = 0603WAF2403T5E: LCSC Part Name: 240kΩ ±1% 100mW 厚膜电阻; Supplier Part: C4197; Manufacturer: UNI-ROYAL(厚声); Supplier Footprint: 0603; JLCPCB Part Class: Extended Part; Datasheet: https://atta.szlcsc.com/upload/public/pdf/source/20200306/C422600_1E6D84923E4A46A82E41ADD87F860B5C.pdf; Supplier: LCSC; Type: 厚膜电阻; Tolerance: ±1%; Power(Watts): 100mW; Overload Voltage (Max): 75V; Temperature Coefficient: ±100ppm/℃; Operating Temperature Range: -55℃~+155℃
R257 R259 = 0603WAF2202T5E: LCSC Part Name: 22kΩ ±1% 100mW 厚膜电阻; Supplier Part: C31850; Manufacturer: UNI-ROYAL(厚声); Supplier Footprint: 0603; Datasheet: https://atta.szlcsc.com/upload/public/pdf/source/20200306/C422600_1E6D84923E4A46A82E41ADD87F860B5C.pdf; Supplier: LCSC; Type: 厚膜电阻; Tolerance: ±1%; Power(Watts): 100mW; Overload Voltage (Max): 75V; Temperature Coefficient: ±100ppm/℃; Operating Temperature Range: -55℃~+155℃
R258 R260 = 0603WAF4701T5E: LCSC Part Name: 4.7kΩ ±1% 100mW 厚膜电阻; Supplier Part: C23162; Manufacturer: UNI-ROYAL(厚声); Supplier Footprint: 0603; Datasheet: https://atta.szlcsc.com/upload/public/pdf/source/20200306/C422600_1E6D84923E4A46A82E41ADD87F860B5C.pdf; Supplier: LCSC; Type: 厚膜电阻; Tolerance: ±1%; Power(Watts): 100mW; Overload Voltage (Max): 75V; Temperature Coefficient: ±100ppm/℃; Operating Temperature Range: -55℃~+155℃
SW1-SW3 SW6 = TS3425BA: LCSC Part Name: 4.2*3.2*2.5mm 立贴 电子烟轻触开关; Supplier Part: C2681476; Manufacturer: SHOU HAN(首韩); Supplier Footprint: SMD-4P,4.2x3.2mm; JLCPCB Part Class: 扩展库; Datasheet: https://item.szlcsc.com/datasheet/TS3425BA/2774819.html; Supplier: LCSC; Circuit: 单刀单掷; Actuator Style: 椭圆形按钮; Operating Force: 2.5N; Mounting Type: 立贴; Length: 4.2mm; Width: 3.2mm; Switch Height: 2.5mm; with Bracket: 不带支架; Contact Current: 50mA; Voltage Rating: 12V; Actuator/Cap Color: 白色; With Lamp: 无; Termination Style: J型引脚; Life: 3万次; Operating Temperature: -20℃~+70℃
SW5 = MK-12C02-G020: LCSC Part Name: 微型拨动开关; Supplier Part: C963206; Manufacturer: G-Switch(品赞); Supplier Footprint: SMD; JLCPCB Part Class: 扩展库; Datasheet: https://atta.szlcsc.com/upload/public/pdf/source/20200902/C778186_2AF08473ED98414D93A175E8814EEFA6.pdf; Supplier: LCSC; Circuit: 单刀双掷; Actuator Style: 矩形柱状; Pin Style: SMD接片; Switch Length: 6.6mm; Switch Width: 2.7mm; Switch Height: 4.7mm; Mounting Style: 卧贴; Actuator Color: 黑色; Current Rating (DC): 1A; Voltage Rating (DC): 6V; Mechanical Life: 1万次; Operating Temperature: -20℃~+70℃
TF2 = TF-CARD H1.8 SY: LCSC Part Name: 9P，自弹式TF卡座; Supplier Part: C7529391; Manufacturer: SHOU HAN(首韩); Supplier Footprint: SMD; JLCPCB Part Class: 扩展库; Datasheet: https://item.szlcsc.com/datasheet/TF-CARD%2520H1.8%2520SY/8629778.html; Supplier: LCSC; Card Connection Mode: 自弹式; Card Type: MicroSD卡(TF卡); Connector Type: 卡座; Height Above Board: 2mm; Operating Temperature: -40℃~+70℃
U7 = ES9018K2M: Supplier Part: C2688377; Manufacturer: ESS; Supplier Footprint: QFN-28-EP(5x5); Datasheet: https://atta.szlcsc.com/upload/public/pdf/source/20240902/3B9DD278974AAF73CF86D9006136DBF3.pdf; Supplier: LCSC
U8 = SABRE9601K: Supplier Part: C2848331; Manufacturer: ESS; Supplier Footprint: QFN-20; JLCPCB Part Class: 扩展库; Datasheet: https://atta.szlcsc.com/upload/public/pdf/source/20210720/C2848331_1C9A1682C8CFC5D55CBB36C711909FB8.pdf; Supplier: LCSC
U16 U17 = MAX98357AETE+T: LCSC Part Name: 微型、低成本、PCM 类 D 级放大器具有 AB 级性能; Supplier Part: C910544; Manufacturer: ADI(亚德诺)/MAXIM(美信); Supplier Footprint: TQFN-16-EP(3x3); Datasheet: https://atta.szlcsc.com/upload/public/pdf/source/20210106/C910544_CB6DE4B2CEE254A72E6BDB40E718D281.pdf; Supplier: LCSC; Speaker Channels: 单声道; Output Power: 3.2Wx2@4Ω; Supply Voltage: 2.5V~5.5V; Operating Temperature: -40℃~+85℃
U21 = 扬声器左: Check: false
U22 = 扬声器右: Check: false
U23 U24 U27 U29 U112 = TS5A3159DCKR: LCSC Part Name: TS5A3159 1-Q SPDT 模拟开关; Supplier Part: C46388; Manufacturer: TI(德州仪器); Supplier Footprint: SC-70-6(SOT-363); JLCPCB Part Class: 扩展库; Datasheet: https://www.ti.com/cn/lit/gpn/ts5a3159; Supplier: LCSC; Switch Circuit: 单刀双掷(SPDT); Number of Channels: 1; Supply Voltage: 1.65V~5.5V; Turn-on time: 35ns; On-State Resistance (Max): 1.1Ω; Turn-off time: 20ns; Operating Temperature: -40℃~+85℃
U97 = WAFER-PH2.0-4PWB: 插针结构:1x4P;间距:2mm;安装方式:卧贴;参考系列:PH;总PIN数:4P;排数:1;每排PIN数:4;行距:-;额定电流:2A;触头材质:黄铜;触头镀层:锡;工作温度:-25℃~+85℃;; LCSC Part Name: 1x4P 间距:2mm 卧贴 系列:PH; Supplier Part: C3029442; Manufacturer: XUNPU(讯普); Supplier Footprint: SMD,P=2mm,卧贴; JLCPCB Part Class: 扩展库; Datasheet: https://item.szlcsc.com/datasheet/WAFER-PH2.0-4PWB/3561454.html; Supplier: LCSC; Pins Structure: 1x4P; Pitch: 2mm; Mounting Type: 卧贴; Reference Series: PH; Number of Pins: 4P; Number of Rows: 1; Number of PINs Per Row: 4; Current Rating: 2A; Contact Material: 黄铜; Contact Plating: 锡; Operating Temperature: -25℃~+85℃; Voltage Rating: 250V; Plastic Material: LCP; Supplementary Features: 辅助焊脚; Color: 米色; Z-Height of the Board: 5.6mm; X-Length of Bottom Edge on Board (Spacing Line): 12mm; Y-Width of Bottom Edge on Board: 7.59mm
U98 = W9825G6KH-6I: LCSC Part Name: 4M×4存储体×16位SDRAM; Supplier Part: C97572; Manufacturer: Winbond(华邦); Supplier Footprint: TSOPII-54-10.2mm; JLCPCB Part Class: 扩展库; Datasheet: https://item.szlcsc.com/datasheet/W9825G6KH-6I/98780.html; Supplier: LCSC; Memory Size: 256Mbit; Clock Frequency: 166MHz; Voltage - Supply: 3V~3.6V; Operating Temperature: -40℃~+85℃
U99 = STM32H743IIT6: LCSC Part Name: 带DSP和DP-FPU的高性能ARM Cortex-M7 MCU，具有2 MB Flash、1 MB RAM、480 MHz CPU、ART加速器、一级缓存、外部存储器接口和大量外设; Supplier Part: C89597; Manufacturer: ST(意法半导体); Supplier Footprint: LQFP-176(24x24); JLCPCB Part Class: 扩展库; Datasheet: https://item.szlcsc.com/datasheet/STM32H743IIT6/90777.html; Supplier: LCSC; CPU Maximum Speed: 480MHz; Program Storage Size: 2MB; Program Memory Type: FLASH; Number of I/O: 140; ADC (Bit): 16bit; DAC (Bit): 12bit; Voltage - Supply: 1.62V~3.6V
U100 = CH340X: Supplier Part: C3035748; Manufacturer: WCH(南京沁恒); Supplier Footprint: MSOP-10; JLCPCB Part Class: 扩展库; Datasheet: https://atta.szlcsc.com/upload/public/pdf/source/20230530/6E401E9554E9F5311886CC8B3F89B62E.pdf; Supplier: LCSC
U103 U104 U111 = RT9013-33GB: 输出类型:固定;最大输入电压:5.5V;输出电压:3.3V;最大输出电流:500mA;电源纹波抑制比(PSRR):50dB@(10kHz);输出极性:正极;; LCSC Part Name: 输入5.5V 输出3.3V 500mA; Supplier Part: C47773; Manufacturer: RICHTEK(立锜); Supplier Footprint: SOT-23-5; Datasheet: https://atta.szlcsc.com/upload/public/pdf/source/20150504/1457707282459.pdf; Supplier: LCSC; Output Type: 固定; Maximum Input Voltage: 5.5V; Output Voltage: 3.3V; MAX Output Current: 500mA; Power Supply Rejection Ratio (PSRR): 50dB@(10kHz); Dropout Voltage: 400mV@(500mA); standby current: 50uA; Operating Temperature: -40℃~+85℃; Output Polarity: 正极; Number of Outputs: 1
U105 = BQ24073RGTR: Supplier Part: C15220; Manufacturer: TI(德州仪器); Supplier Footprint: QFN-16-EP(3x3); JLCPCB Part Class: 扩展库; Datasheet: http://www.ti.com/cn/lit/gpn/bq24075; Supplier: LCSC; Supply Voltage: 6.4V; Maximum Charge Current: 1.5A; Type of Battery: 锂离子/聚合物; Number of Cells: 1; Operating Temperature: -40℃~+125℃
U106 = BX-PH2.0-3PWZ: LCSC Part Name: 配套胶壳型号：BX-PH2.0-3PJK 配套端子型号：BX-PH2.0-DZ 配套杜邦线型号：BX-PH2.0-3PBXC; Supplier Part: C18077754; Manufacturer: Bossie(博锡); Supplier Footprint: 弯插,P=2mm; JLCPCB Part Class: 扩展库; Datasheet: https://atta.szlcsc.com/upload/public/pdf/source/20231017/9F0813E52D17B74B32E8D0E9B939B491.pdf; Supplier: LCSC; Pins Structure: 1x3P; Pitch: 2mm; Mounting Style: 弯插; Reference Series: PH; Number of Pins: 3P; Number of Rows: 1; Number of PINs Per Row: 3; Current Rating (Max): 2A; Contact Material: 黄铜; Contact Plating: 锡; Operating Temperature Range: -25℃~+85℃
U107 = TPS22917DBVR: Supplier Part: C2681320; Manufacturer: TI(德州仪器); Supplier Footprint: SOT-23-6; JLCPCB Part Class: 扩展库; Datasheet: https://www.ti.com/cn/lit/gpn/tps22917; Supplier: LCSC; Type: 负载开关; Number of Channels: 1; Control Input Logic: 高电平有效; Maximum Continuous Current: 2A; Voltage - Supply: 0V~5.5V; RDS(on): 80mΩ; Operating Temperature	-: -40℃~+125℃
U108 = TLV61070ADBVR: LCSC Part Name: 2.5A同步升压转换器,支持0.5V超低输入电压; Supplier Part: C6881375; Manufacturer: TI(德州仪器); Supplier Footprint: SOT-23-6; JLCPCB Part Class: 扩展库; Datasheet: https://atta.szlcsc.com/upload/public/pdf/source/20230721/C6AC513B5543490C8D3B916506A0AE8A.pdf; Supplier: LCSC; Function: 升压型; Output Type: 可调; Input Voltage: 500mV~5.5V; Output Voltage: 2.2V~5.5V; Output Current: 2.5A; Switching Frequency: 1MHz；550kHz; Operating Temperature: -40℃~+125℃@(TJ); Synchronous Rectification: 是; Number of Outputs: 1; Topology: 升压式; Switch tube (built-in/external): 内置
U109 U110 = TPS7A8001DRBR: LCSC Part Name: 具有低 IQ 和使能功能的 1A、高 PSRR、超低压降稳压器; Supplier Part: C105265; Manufacturer: TI(德州仪器); Supplier Footprint: VSON-8-EP(3x3); Datasheet: https://www.ti.com/cn/lit/gpn/tps7a80; Supplier: LCSC; Output Type: 可调; Maximum Input Voltage: 6.5V; Output Voltage: 800mV~6V; Output Current: 1A; Power Supply Rejection Ratio (PSRR): 63dB; Dropout Voltage: 500mV@(1A); Feature: 防静电保护；软启动；浪涌保护；低ESR；热保护(TSD)；欠压闭锁；过流保护(OCP)；带使能; Output Polarity: 正极; Number of Outputs: 1
USB3 USB4 = TYPE-C 16PIN 2MD(073): 连接器类型:Type-C;标准:USB 3.1;公母:母;安装方式:卧贴;触点数量:16P;端口数量:1;额定电流 - 电源:5A;工作温度范围:-25℃~+85℃;; LCSC Part Name: Type-C 母 卧贴; Supplier Part: C2765186; Manufacturer: SHOU HAN(首韩); Supplier Footprint: SMD; JLCPCB Part Class: 扩展库; Datasheet: https://atta.szlcsc.com/upload/public/pdf/source/20211123/39B17C16241EAC15C5E277BDA434118E.pdf; Supplier: LCSC; Connector Type: Type-C; Standard: USB 3.1; Gender: 母; Mounting Style: 卧贴; Number of Contacts: 16P; Number of Ports: 1; Current Rating - Power (Max): 5A; Operating Temperature Range: -25℃~+85℃; Rated Voltage (Max): 5V; Connect-Disconnect Life: 5千次; Core Colour: 黑色
X1 = X321532768KGD2SI: 晶振类型:贴片晶振;频率:32.768kHz;常温频差:±20ppm;外接负载电容:12.5pF;频率稳定度(全温):-;; LCSC Part Name: 32.768kHz ±20ppm 12.5pF; Supplier Part: C620155; Manufacturer: YXC(扬兴晶振); Supplier Footprint: SMD3215-2P; JLCPCB Part Class: 扩展库; Datasheet: https://atta.szlcsc.com/upload/public/pdf/source/20240329/3A7650FD985DD0DE85694D3785AB4916.pdf; Supplier: LCSC; Crystal Type: 贴片晶振; Normal temperature Frequency Tolerance: ±20ppm; External load capacitor: 12.5pF; Operating Temperature: -40℃~+85℃
X2 = X322525MOB4SI: 晶振类型:贴片晶振;频率:25MHz;常温频差:±10ppm;负载电容:12pF;频率稳定度:±20ppm;; LCSC Part Name: 25MHz ±10ppm 12pF; Supplier Part: C9006; Manufacturer: YXC(扬兴晶振); Supplier Footprint: SMD3225-4P; JLCPCB Part Class: 基础库; Datasheet: https://atta.szlcsc.com/upload/public/pdf/source/20240329/19D5F850207469550BEB00D7DFEDBC7A.pdf; Supplier: LCSC; Type: 贴片晶振; Normal temperature Frequency Tolerance: ±10ppm; Load Capacitance: 12pF; Frequency Stability: ±20ppm; Operating Temperature: -40℃~+85℃
X3 X4 = GH125-S02DCA-00: LCSC Part Name: 1x2P 间距:1.25mm 卧贴; Supplier Part: C2886765; Manufacturer: JS(钜硕电子); Supplier Footprint: SMD,P=1.25mm,卧贴; JLCPCB Part Class: 扩展库; Datasheet: https://item.szlcsc.com/datasheet/GH125-S02DCA-00/3101261.html; Supplier: LCSC; Pins Structure: 1x2P; Pitch: 1.25mm; Mounting Type: 卧贴; Number of Pins: 2P; Number of Rows: 1; Number of PINs Per Row: 2; Current Rating: 1A; Operating Temperature: -25℃~+85℃

## Nets
AGND: AUDIO1.1 AUDIO1.2 C7.2 C9.2 C16.1 C18.1 C20.2 C27.1 C28.1 C29.2 C30.1 C481.1 C482.1 C483.1 C484.1 D51.2 D52.2 D53.2 OSC1.2(GND) R2.2 R8.1 R52.1 R53.1 R265.2 U7.8(AGND) U7.11(AGND_R) U7.12(AGND_L) U8.4(AGND_CP) U8.5(AGND) U8.13(AGND) U8.21(EP) U99.37(VSSA) U104.2(GND)
GND: C1.1 C2.1 C3.2 C4.2 C6.1 C17.1 C23.2 C24.2 C43.2 C47.2 C49.1 C50.2 C52.1 C53.1 C54.2 C55.1 C57.2 C68.1 C430.2 C431.2 C432.2 C433.2 C434.2 C435.2 C436.2 C437.2 C438.2 C439.1 C440.1 C453.2 C454.1 C455.1 C456.1 C457.1 C458.1 C459.1 C460.1 C461.1 C462.1 C465.2 C478.1 C479.1 C480.1 C485.1 C486.2 C487.1 C488.1 C489.1 C490.1 C491.2 C492.2 C493.2 C494.2 C495.2 C496.1 C497.1 C498.1 C499.1 C500.2 C501.1 C502.1 C503.1 C504.1 C505.1 C506.1 C507.1 C508.1 C509.1 D54.1 D55.1 D56.1(C) D57.1 D58.1 D59.1(C) D60.2(A) FPC2.12 FPC2.21 FPC2.30 FPC2.41 FPC2.42 H1.1 LED7.2(C) R9.1 R33.2 R36.1 R42.1 R57.1 R245.1 R246.2 R248.1 R249.1 R252.2 R253.2 R254.2 R258.1 R260.1 R261.1 R262.1 R265.1 R266.1 SW3.2 SW3.4 TF2.6(VSS) TF2.10(GND) TF2.11(GND) TF2.12(GND) TF2.13(GND) U7.1(DGND) U7.5(ADDR) U7.20(DGND) U7.29(EP) U16.3(GND) U16.11(GND) U16.15(GND) U16.17(EP) U17.3(GND) U17.11(GND) U17.15(GND) U17.17(EP) U23.2(GND) U24.2(GND) U27.2(GND) U29.2(GND) U97.1 U97.5 U97.6 U98.6(VSSQ) U98.12(VSSQ) U98.28(VSS) U98.41(VSS) U98.46(VSSQ) U98.52(VSSQ) U98.54(VSS) U99.14(VSS) U99.22(VSS) U99.48(VSS) U99.61(VSS) U99.71(VSS) U99.90(VSS) U99.102(VSS) U99.113(VSS) U99.126(VSS) U99.135(VSS) U99.148(VSS) U99.158(VSS) U100.3(GND) U103.2(GND) U105.4(CE#) U105.6(EN1) U105.8(VSS) U105.15(TD) U105.17(EP) U106.1 U107.2(GND) U108.2(GND) U109.4(GND) U109.9(EP) U110.4(GND) U110.9(EP) U111.2(GND) U112.2(GND) USB3.1(GND) USB3.12(GND) USB4.1(GND) USB4.3(SBU2) USB4.9(SBU1) USB4.12(GND) USB4.13(SHELL) USB4.14(SHELL) X2.2(GND) X2.4(GND)
V4.5L: C49.2 C50.1 C497.2 R22.2 R257.1 U16.2(GAIN_SLOT) U16.7(VDD) U16.8(VDD) U109.1(OUT) U109.2(OUT)
V4.5R: C53.2 C54.1 C498.2 R23.1 R259.1 U17.2(GAIN_SLOT) U17.7(VDD) U17.8(VDD) U110.1(OUT) U110.2(OUT)
VBAT: C487.2 R250.2 U105.2(BAT) U105.3(BAT) U105.5(EN2) U106.3 U112.3(NC)
VBATADC: R247.2 U112.4(COM)
VBUS-A: C486.1 D56.2(A) U105.13(IN) USB3.2(VBUS) USB3.11(VBUS)
VCC3V3: C23.1 C24.1 C465.1 C479.2 C480.2 L14.1 R60.1 R61.1 R62.1 R63.1 R64.1 R263.1 R267.1 TF2.4(VDD) U23.5(V+) U27.5(V+) U29.5(V+) U97.4 U100.7(VCC) U100.10(V3) U103.5(VOUT) U112.5(V+)
VCC5V: C478.2 C481.2 C484.2 C485.2 C493.1 C494.1 C495.1 C500.1 C501.2 C504.2 D59.2(A) L12.1 R255.2 U103.1(VIN) U103.3(EN) U104.1(VIN) U104.3(EN) U108.5(VOUT) U109.5(EN) U109.7(IN) U109.8(IN) U110.5(EN) U110.7(IN) U110.8(IN) U111.1(VIN) U111.3(EN) USB4.2(VBUS) USB4.11(VBUS)
VDD: C454.2 C455.2 C456.2 C457.2 C458.2 C459.2 C460.2 C461.2 C462.2 L14.2 R59.1 U99.6(VBAT) U99.15(VDD) U99.23(VDD) U99.36(VDD) U99.49(VDD) U99.62(VDD) U99.72(VDD) U99.82(VDD) U99.91(VDD) U99.103(VDD) U99.114(VDD33USB) U99.127(VDD) U99.136(VDD) U99.149(VDD) U99.159(VDD) U99.172(VDD)
VDD_SDRAM: C431.1 C432.1 C433.1 C434.1 C435.1 C436.1 C437.1 C438.1 L13.2 R56.2 U98.1(VDD) U98.3(VDDQ) U98.9(VDDQ) U98.14(VDD) U98.27(VDD) U98.43(VDDQ) U98.49(VDDQ)
VDDA: C7.1 C18.2 C28.2 C482.2 C483.2 L1.2 L2.2 L11.2 R3.2 R16.2 R54.1 U7.15(AVCC_L) U7.16(AVCC_R) U8.1(AVCC_CP) U8.6(PDB) U8.14(AVCC_R) U8.15(AVCC_L) U99.39(VDDA) U104.5(VOUT)
3.5L: AUDIO1.3 C15.1 D51.1 R6.2 R7.1 R52.2
3.5R: AUDIO1.4 C19.2 D52.1 R10.2 R11.1 R53.2
ADC_BAT_OUT: U99.54(PC4)
BL_CTR: FPC2.7 U99.100(PD12)
BOOT0: R9.2 U99.166(BOOT0) U100.6(TNOW/DTR#)
CH340_D+: D55.2 U100.1(UD+) USB3.6(DP1) USB3.8(DP2)
CH340_D-: D54.2 U100.2(UD-) USB3.5(DN2) USB3.7(DN1)
CHG: LED6.2(C) R263.2 U99.47(PA3) U105.9(CHG#) U112.6(IN)
CTP_INT: FPC2.2 U99.84(PH7)
CTP_RST: FPC2.6 U99.101(PD13)
CTP_SCL: FPC2.3 U99.115(PC6)
CTP_SDA: FPC2.5 U99.116(PC7)
DAC_L: C9.1 R2.1 U7.13(DACL) U8.19(INL)
DAC_LB: C15.2 R7.2 U7.14(DACLB) U8.18(INBL)
DAC_OSC: OSC1.3(OUT) U7.7(XI(MCLK))
DAC_P1: U7.24(GPIO1) U99.162(PB4)
DAC_P2: U7.23(GPIO2) U99.161(PB3)
DAC_R: C16.2 R8.2 U7.9(DACR) U8.7(INR)
DAC_RB: C19.1 R10.1 U7.10(DACRB) U8.8(INBR)
FMC_A0: U98.23(A0) U99.16(PF0)
FMC_A1: U98.24(A1) U99.17(PF1)
FMC_A2: U98.25(A2) U99.18(PF2)
FMC_A3: U98.26(A3) U99.19(PF3)
FMC_A4: U98.29(A4) U99.20(PF4)
FMC_A5: U98.30(A5) U99.21(PF5)
FMC_A6: U98.31(A6) U99.60(PF12)
FMC_A7: U98.32(A7) U99.63(PF13)
FMC_A8: U98.33(A8) U99.64(PF14)
FMC_A9: U98.34(A9) U99.65(PF15)
FMC_A10: U98.22(A10/AP) U99.66(PG0)
FMC_A11: U98.35(A11) U99.67(PG1)
FMC_A12: U98.36(A12) U99.106(PG2)
FMC_BS0: U98.20(BS0) U99.108(PG4)
FMC_BS1: U98.21(BS1) U99.109(PG5)
FMC_D0: U98.2(DQ0) U99.104(PD14)
FMC_D1: U98.4(DQ1) U99.105(PD15)
FMC_D2: U98.5(DQ2) U99.142(PD0)
FMC_D3: U98.7(DQ3) U99.143(PD1)
FMC_D4: U98.8(DQ4) U99.68(PE7)
FMC_D5: U98.10(DQ5) U99.69(PE8)
FMC_D6: U98.11(DQ6) U99.70(PE9)
FMC_D7: U98.13(DQ7) U99.73(PE10)
FMC_D8: U98.42(DQ8) U99.74(PE11)
FMC_D9: U98.44(DQ9) U99.75(PE12)
FMC_D10: U98.45(DQ10) U99.76(PE13)
FMC_D11: U98.47(DQ11) U99.77(PE14)
FMC_D12: U98.48(DQ12) U99.78(PE15)
FMC_D13: U98.50(DQ13) U99.96(PD8)
FMC_D14: U98.51(DQ14) U99.97(PD9)
FMC_D15: U98.53(DQ15) U99.98(PD10)
FMC_NBL0: U98.15(LDQM) U99.169(PE0)
FMC_NBL1: U98.39(UDQM) U99.170(PE1)
FMC_SDCKE0: U98.37(CKE) U99.43(PH2)
FMC_SDCLK: U98.38(CLK) U99.112(PG8)
FMC_SDNCAS: U98.17(CAS#) U99.160(PG15)
FMC_SDNE0: R56.1 U98.19(CS#) U99.44(PH3)
FMC_SDNRAS: U98.18(RAS#) U99.59(PF11)
FMC_SDNWE: U98.16(WE#) U99.32(PC0)
HDP_IN: AUDIO1.6 D53.1 R54.2 U99.134(PI3)
I2C1_SCL: U7.3(SCL) U99.164(PB6)
I2C1_SDA: U7.4(SDA) U99.165(PB7)
I2S1_CK: U27.4(COM) U99.154(PG11)
I2S1_CK1: U7.27(DATA_CLK) U27.3(NC)
I2S1_CK2: U16.16(BCLK) U17.16(BCLK) U27.1(NO)
I2S1_CTRL: U23.6(IN) U27.6(IN) U29.6(IN) U99.55(PC5)
I2S1_SDI: U99.52(PA6)
I2S1_SDO: U29.4(COM) U99.151(PD7)
I2S1_SDO1: U7.25(DATA2) U29.3(NC)
I2S1_SDO2: U16.1(DIN) U17.1(DIN) U29.1(NO)
I2S1_WS: U23.4(COM) U99.153(PG10)
I2S1_WS1: U7.26(DATA1) U23.3(NC)
I2S1_WS2: U16.14(LRCLK) U17.14(LRCLK) U23.1(NO)
KEY0: R266.2 SW6.2 SW6.4 U99.41(PA1)
KEY1: R57.2 SW2.2 SW2.4 U99.46(PH5)
LCD_B0: FPC2.20 U99.157(PG14)
LCD_B1: FPC2.19 U99.155(PG12)
LCD_B2: FPC2.18 U99.150(PD6)
LCD_B3: FPC2.17 U99.119(PA8)
LCD_B4: FPC2.16 U99.173(PI4)
LCD_B5: FPC2.15 U99.174(PI5)
LCD_B6: FPC2.14 U99.175(PI6)
LCD_B7: FPC2.13 U99.176(PI7)
LCD_DEN: FPC2.8 U99.28(PF10)
LCD_G0: FPC2.29 U99.4(PE5)
LCD_G1: FPC2.28 U99.5(PE6)
LCD_G2: FPC2.27 U99.128(PH13)
LCD_G3: FPC2.26 U99.129(PH14)
LCD_G4: FPC2.25 U99.130(PH15)
LCD_G5: FPC2.24 U99.131(PI0)
LCD_G6: FPC2.23 U99.132(PI1)
LCD_G7: FPC2.22 U99.133(PI2)
LCD_HSYNC: FPC2.10 U99.12(PI10)
LCD_PCLK: FPC2.11 U99.111(PG7)
LCD_R0: FPC2.38 U99.156(PG13)
LCD_R1: FPC2.37 U99.42(PA2)
LCD_R2: FPC2.36 U99.85(PH8)
LCD_R3: FPC2.35 U99.86(PH9)
LCD_R4: FPC2.34 U99.87(PH10)
LCD_R5: FPC2.33 U99.88(PH11)
LCD_R6: FPC2.32 U99.89(PH12)
LCD_R7: FPC2.31 U99.110(PG6)
LCD_RST: FPC2.1 U99.99(PD11)
LCD_VSYNC: FPC2.9 U99.11(PI9)
LED0: LED8.2(C) U99.45(PH4)
NRST: C453.1 D45.1(A) R58.1 SW3.1 SW3.3 U99.31(NRST)
NTC: U105.1(TS) U106.2
RTP_MISO: FPC2.4
SDIO_CD: R267.2 TF2.CD U99.138(PA15)
SDIO_CLK: TF2.5(CLK) U99.141(PC12)
SDIO_CMD: R62.2 TF2.3(CMD) U99.144(PD2)
SDIO_D0: R61.2 TF2.7(DAT0) U99.117(PC8)
SDIO_D1: R60.2 TF2.8(DAT1) U99.118(PC9)
SDIO_D2: R64.2 TF2.1(DAT2) U99.139(PC10)
SDIO_D3: R63.2 TF2.2(CD/DAT3) U99.140(PC11)
SWCLK: U97.2 U99.137(PA14)
SWDIO: U97.3 U99.124(PA13)
USART1_RX: H1.3 U99.95(PB15)
USART1_TX: H1.2 U99.94(PB14)
USART3_RX: U99.80(PB11) U100.9(RXD)
USART3_TX: U99.79(PB10) U100.8(TXD)
USB_CTRL: R33.1 U24.6(IN) U99.120(PA9)
USB_DN: D57.2 U99.122(PA11) USB4.5(DN2) USB4.7(DN1)
USB_DP: D58.2 U99.123(PA12) USB4.6(DP1) USB4.8(DP2)
USB_ID: D60.1(C) U24.4(COM) U99.121(PA10) USB4.4(CC1) USB4.10(CC2)
V_ADC: R247.1 R248.2 U99.56(PB0)
VOUT-A: C488.2 C490.2 SW5.2 U105.10(OUT) U105.11(OUT) U107.1(VIN)
VOUT-B: C492.1 C505.2 C506.2 C507.2 C508.2 L15.2 R251.1 R256.2 U108.3(EN) U108.6(VIN) U112.1(NO)
VP3V3: C68.2 C502.2 C503.2 L13.1 R35.1 R58.2 R268.2 SW1.1 SW1.3 SW2.1 SW2.3 SW6.1 SW6.3 U24.5(V+) U111.5(VOUT)
WAKE_UP: R42.2 SW1.2 SW1.4 U99.40(PA0-WKUP)
$1N1316: C2.2 U99.10(PC15-OSC32_OUT) X1.1
$1N1318: C4.1 U99.29(PH0-OSC_IN) X2.3(OSC2)
$1N1322: C3.1 U99.30(PH1-OSC_OUT) X2.1(OSC1)
$1N1389: C1.2 U99.9(PC14-OSC32_IN) X1.2
$1N1406: L11.1 U99.38(VREF+)
$1N6642: C439.2 U99.125(VCAP2)
$1N7205: C440.2 U99.81(VCAP1)
$1N8974: R59.2 U99.171(PDR_ON)
$1N14116: D45.2(K) U100.4(RTS#)
$1N19807: R36.2 U24.3(NC)
$1N19811: C57.1 R35.2 U24.1(NO)
$1N20886: R23.2 U17.4(SD_MODE#)
$1N20889: L4.1 U16.10(OUTN)
$1N20890: L5.1 U16.9(OUTP)
$1N20895: L6.1 U17.10(OUTN)
$1N20896: L7.1 U17.9(OUTP)
$1N20897: C47.1 L6.2 X3.2
$1N20898: C55.2 L7.2 X3.1
$1N20902: R22.1 U16.4(SD_MODE#)
$1N25291: C17.2 U7.21(DVDD)
$1N25312: R11.2 U8.9(OUTR)
$1N25313: R6.1 U8.17(OUTL)
$1N25322: C20.1 U8.11(ANEG) U8.12(PNEG)
$1N25325: C8.2 U8.3(C2)
$1N25332: C6.2 R3.1 U7.28(RESETB)
$1N25339: C29.1 L2.1 OSC1.4(VCC)
$1N25342: C27.2 R16.1 U7.18(DVCC)
$1N25343: C30.2 L1.1 U7.17(VCCA)
$1N25346: C8.1 U8.2(C1)
$1N28919: R246.1 U105.16(ISET)
$1N28920: R245.2 U105.14(TMR)
$1N28935: R249.2 U105.12(ILIM)
$1N28942: C491.1 R251.2 U107.5(QOD) U107.6(VOUT)
$1N28948: C489.2 U107.4(CT)
$1N28952: R252.1 USB3.4(CC1)
$1N28954: R253.1 USB3.10(CC2)
$1N28967: R254.1 R255.1 U108.4(FB)
$1N28969: L15.1 U108.1(SW)
$1N28997: R257.2 R258.2 U109.3(FB/SNS)
$1N29000: C496.2 U109.6(NR)
$1N29005: C499.2 U110.6(NR)
$1N29006: R259.2 R260.2 U110.3(FB/SNS)
$1N29015: C509.2 R261.2 USB3.13(SHELL) USB3.14(SHELL)
$1N81031: C430.1 FPC2.39 FPC2.40 L12.2
Net-(C43-1): C43.1 L4.2 X4.2
Net-(C52-2): C52.2 L5.2 X4.1
Net-(LED6-1): LED6.1(A) R250.1
Net-(LED7-1): LED7.1(A) R256.1
Net-(LED8-1): LED8.1(A) R268.1
Net-(R262-2): R262.2 SW5.1 U107.3(ON)

Not connected (* = marked no-connect by the designer): AUDIO1 5*; OSC1 1(NC/VC)*; SW5 3* 4* 5* 6* 7*; U7 2(N.C.)* 6(XO)* 19(N.C.)* 22(N.C.)*; U8 10(NC)* 16(NC)* 20(OSC)*; U16 5(N.C.)* 6(N.C.)* 12(N.C.)* 13(N.C.)*; U17 5(N.C.)* 6(N.C.)* 12(N.C.)* 13(N.C.)*; U98 40(NC)*; U99 1(PE2) 2(PE3) 3(PE4) 7(PI8) 8(PC13) 13(PI11) 24(PF6) 25(PF7) 26(PF8) 27(PF9) 33(PC1) 34(PC2_C) 35(PC3_C) 50(PA4) 51(PA5) 53(PA7) 57(PB1) 58(PB2) 83(PH6) 92(PB12) 93(PB13) 107(PG3) 145(PD3) 146(PD4) 147(PD5) 152(PG9) 163(PB5) 167(PB8) 168(PB9); U100 5(CTS#)*; U103 4(NC)*; U104 4(NC)*; U105 7(PGOOD#)*; U111 4(NC)*; USB3 3(SBU2)* 9(SBU1)*; X3 3* 4*; X4 3* 4*

## Notes on the sheet
- UART4
- 控制台调试串口
- iis切换
- 置0为耳机  置1为喇叭
- 模拟开关
- typec主从切换
- SD卡
- 主控
- LCD+SDRAM
- ES9601k
- 3.5mm耳机
- ES9018K2M
- 3ms延迟启动
- 喇叭dac+功放左
- 喇叭dac+功放右
- 建议电阻0.1%精度,电容COG/NP0
- 0.1%
- DAC晶振
- 耳机
- 扬声器
- 电池接口
- 锂电池充放电管理
- 开机指示
- 升压dcdc
- 数字ldo
- 模拟ldo
- 外设ldo
- VBAT IN
- 开关机
- vout = 4.94v
- 4.4V MAX
- 电流测试点
- 700ma
- 400ma
- 或tps22918
- 0-50°C
- Iq = 20uA .typ
- 7.5h
- ISD = 0.5uA .typ
- 对外供电及USB通信
  可单独供电但不对电池充电
- 充电时低电平
- 4.5V LDO
- 电量检测
- 4.5V LDO
- 电量测量切换
- 先过内部运放跟随后
  再内部接入adc
- VCC IN
- VCC IN
- V4.5 OUT
- V4.5 OUT
- 充电时直接测量电池电压
  不充电时测量开机后的VOUT-B
- OTA及供电/充电COM
- 电源域
